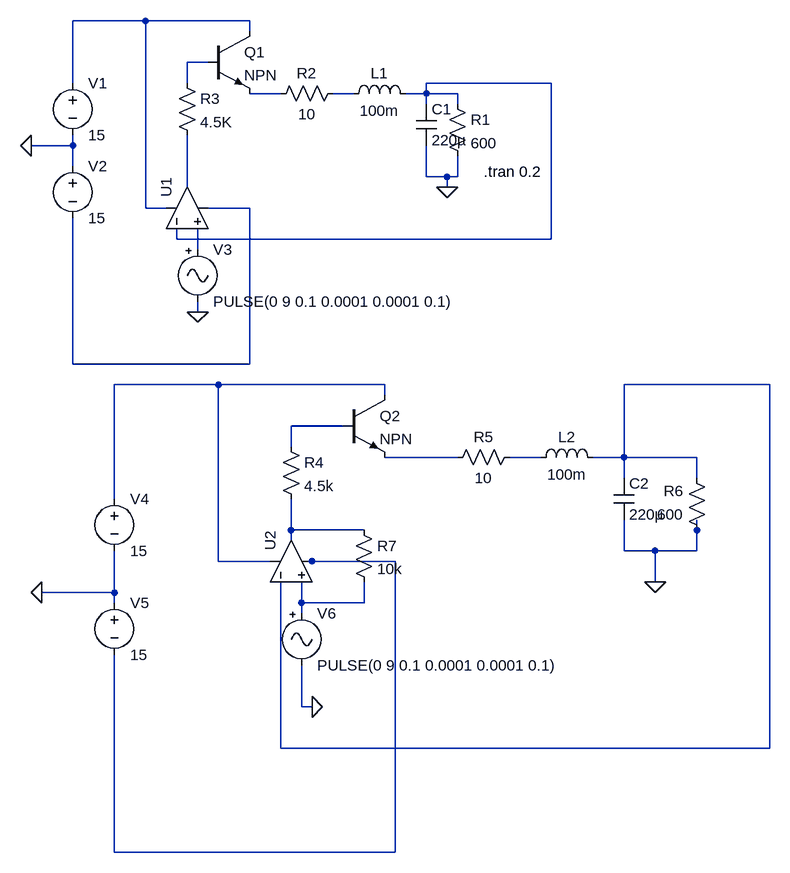
[diagram p0: schematic ACTIVIDAD RETO.asc]
ACTIVIDAD RETO.asc, the LTspice schematic file:
Version 4.1
SHEET 1 1092 1236
WIRE 128 -48 16 -48
WIRE 288 -48 128 -48
WIRE 288 -32 288 -48
WIRE 224 16 192 16
WIRE 16 48 16 -48
WIRE 192 48 192 16
WIRE 752 48 560 48
WIRE 336 64 288 64
WIRE 448 64 416 64
WIRE 560 64 560 48
WIRE 560 64 528 64
WIRE 608 64 560 64
WIRE 560 80 560 64
WIRE 608 80 608 64
WIRE 16 144 16 128
WIRE 16 144 -48 144
WIRE 16 176 16 144
WIRE 560 192 560 144
WIRE 592 192 560 192
WIRE 608 192 608 160
WIRE 608 192 592 192
WIRE 192 208 192 128
WIRE 592 208 592 192
WIRE 128 240 128 -48
WIRE 160 240 128 240
WIRE 288 240 224 240
WIRE 176 288 176 272
WIRE 752 288 752 48
WIRE 752 288 176 288
WIRE 208 304 208 272
WIRE 208 400 208 384
WIRE 16 480 16 256
WIRE 288 480 288 240
WIRE 288 480 16 480
WIRE 240 512 80 512
WIRE 496 512 240 512
WIRE 1088 512 864 512
WIRE 496 528 496 512
WIRE 432 576 352 576
WIRE 352 608 352 576
WIRE 608 624 496 624
WIRE 736 624 688 624
WIRE 864 624 864 512
WIRE 864 624 816 624
WIRE 976 624 864 624
WIRE 864 656 864 624
WIRE 976 656 976 624
WIRE 80 688 80 512
WIRE 352 736 352 688
WIRE 464 736 352 736
WIRE 976 736 976 720
WIRE 352 752 352 736
WIRE 864 768 864 720
WIRE 912 768 864 768
WIRE 976 768 976 736
WIRE 976 768 912 768
WIRE 240 784 240 512
WIRE 320 784 240 784
WIRE 384 784 368 784
WIRE 512 784 384 784
WIRE 912 816 912 768
WIRE 80 832 80 768
WIRE 80 832 -32 832
WIRE 80 848 80 832
WIRE 368 848 368 816
WIRE 464 848 464 816
WIRE 464 848 368 848
WIRE 368 864 368 848
WIRE 368 1008 368 944
WIRE 384 1008 368 1008
WIRE 336 1072 336 816
WIRE 1088 1072 1088 512
WIRE 1088 1072 336 1072
WIRE 80 1232 80 928
WIRE 512 1232 512 784
WIRE 512 1232 80 1232
FLAG -48 144 0
FLAG 592 208 0
FLAG 208 400 0
FLAG 912 816 0
FLAG 384 1008 0
FLAG -32 832 0
SYMBOL voltage 16 32 R0
SYMATTR InstName V1
SYMATTR Value 15
SYMBOL voltage 16 160 R0
SYMATTR InstName V2
SYMATTR Value 15
SYMBOL res 592 64 R0
SYMATTR InstName R1
SYMATTR Value 600
SYMBOL res 432 48 R90
WINDOW 0 0 56 VBottom 2
WINDOW 3 32 56 VTop 2
SYMATTR InstName R2
SYMATTR Value 10
SYMBOL ind 432 80 R270
WINDOW 0 32 56 VTop 2
WINDOW 3 5 56 VBottom 2
SYMATTR InstName L1
SYMATTR Value 100m
SYMBOL cap 544 80 R0
SYMATTR InstName C1
SYMATTR Value 220µ
SYMBOL npn 224 -32 R0
SYMATTR InstName Q1
SYMBOL res 176 32 R0
SYMATTR InstName R3
SYMATTR Value 4.5K
SYMBOL Misc\\signal 208 288 R0
SYMATTR InstName V3
SYMATTR Value PULSE(0 9 0.1 0.0001 0.0001 0.1)
SYMBOL OpAmps\\UniversalOpAmp2 192 240 R270
SYMATTR InstName U1
SYMBOL voltage 80 672 R0
SYMATTR InstName V4
SYMATTR Value 15
SYMBOL voltage 80 832 R0
SYMATTR InstName V5
SYMATTR Value 15
SYMBOL OpAmps\\UniversalOpAmp2 352 784 R270
SYMATTR InstName U2
SYMBOL npn 432 528 R0
SYMATTR InstName Q2
SYMBOL res 336 592 R0
SYMATTR InstName R4
SYMATTR Value 4.5k
SYMBOL res 704 608 R90
WINDOW 0 0 56 VBottom 2
WINDOW 3 32 56 VTop 2
SYMATTR InstName R5
SYMATTR Value 10
SYMBOL res 992 752 R180
WINDOW 0 36 76 Left 2
WINDOW 3 36 40 Left 2
SYMATTR InstName R6
SYMATTR Value 600
SYMBOL ind 720 640 R270
WINDOW 0 32 56 VTop 2
WINDOW 3 5 56 VBottom 2
SYMATTR InstName L2
SYMATTR Value 100m
SYMBOL cap 848 656 R0
SYMATTR InstName C2
SYMATTR Value 220µ
SYMBOL Misc\\signal 368 848 R0
SYMATTR InstName V6
SYMATTR Value PULSE(0 9 0.1 0.0001 0.0001 0.1)
SYMBOL res 448 720 R0
SYMATTR InstName R7
SYMATTR Value 10k
TEXT 648 184 Left 2 !.tran 0.2

The netlist it stands for:
* ACTIVIDAD RETO.asc
V1 N001 0 15
V2 0 N007 15
R1 N003 0 600
R2 N005 N004 10
L1 N005 N003 100m
C1 N003 0 220µ
Q1 N001 N002 N004 0 NPN
R3 N002 N006 4.5K
V3 N008 0 PULSE(0 9 0.1 0.0001 0.0001 0.1)
X§U1 N008 N003 N001 N007 N006 level2 Avol=1Meg GBW=10Meg Slew=10Meg Ilimit=25m Rail=0 Vos=0 En=0 Enk=0 In=0 Ink=0 Rin=500Meg  ; pins In+ In- V+ V- OUT
V4 N009 0 15
V5 0 N015 15
X§U2 N016 N010 N009 N015 N014 level2 Avol=1Meg GBW=10Meg Slew=10Meg Ilimit=25m Rail=0 Vos=0 En=0 Enk=0 In=0 Ink=0 Rin=500Meg  ; pins In+ In- V+ V- OUT
Q2 N009 N011 N012 0 NPN
R4 N011 N014 4.5k
R5 N013 N012 10
R6 0 N010 600
L2 N013 N010 100m
C2 N010 0 220µ
V6 N016 0 PULSE(0 9 0.1 0.0001 0.0001 0.1)
R7 N014 N016 10k
.model NPN NPN
.model PNP PNP
.lib standard.bjt
.tran 0.2
.lib UniversalOpAmp2.lib
.backanno
.end